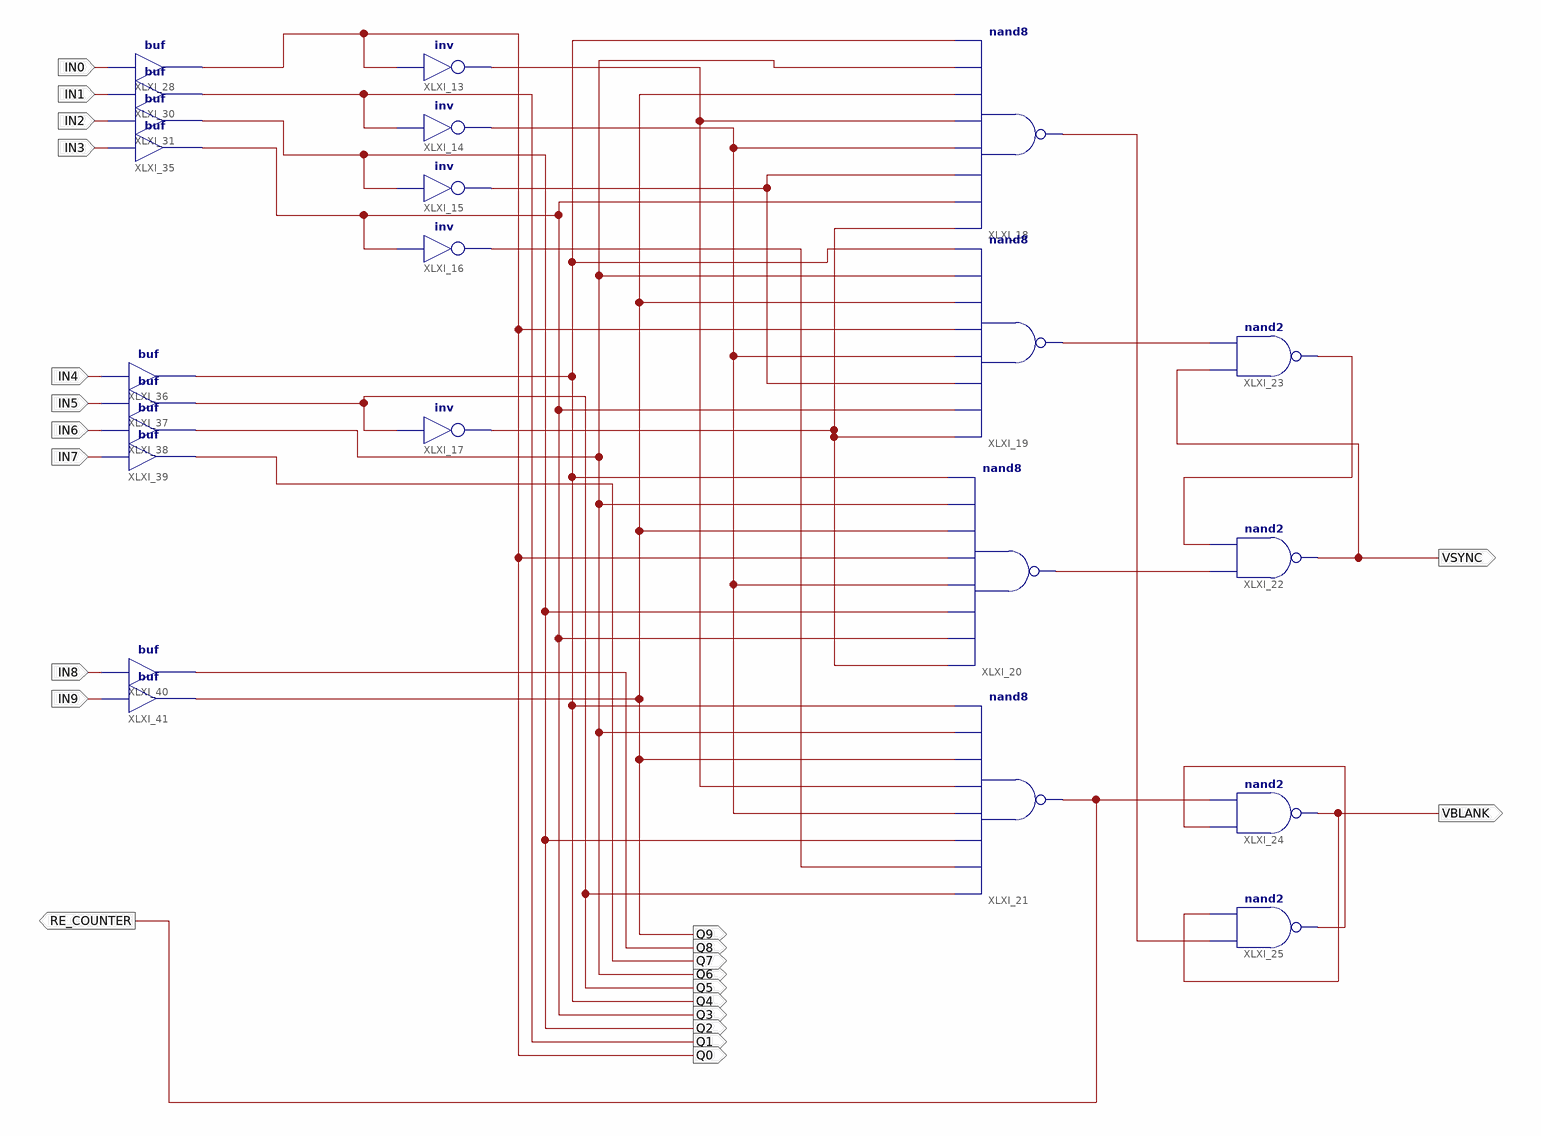
[diagram p0: schematic sheet 1]
// Xilinx ISE schematic vsync.sch (spartan6) as structural Verilog: 23 symbols, 23 ports
module vsync (
  input  IN0,
  input  IN1,
  input  IN2,
  input  IN3,
  input  IN4,
  input  IN5,
  input  IN6,
  input  IN7,
  input  IN8,
  input  IN9,
  output Q0,
  output Q1,
  output Q2,
  output Q3,
  output Q4,
  output Q5,
  output Q6,
  output Q7,
  output Q8,
  output Q9,
  output VSYNC,
  output VBLANK,
  output RE_COUNTER
);

  wire XLXN_35, XLXN_38, XLXN_40, XLXN_42, XLXN_44, XLXN_84, XLXN_89, XLXN_90, XLXN_91, XLXN_93;

  not XLXI_13 (XLXN_35, Q0);
  not XLXI_14 (XLXN_38, Q1);
  not XLXI_15 (XLXN_40, Q2);
  not XLXI_16 (XLXN_42, Q3);
  not XLXI_17 (XLXN_44, Q5);
  nand XLXI_18 (XLXN_89, XLXN_44, Q3, XLXN_40, XLXN_38, XLXN_35, Q9, Q6, Q4);
  nand XLXI_19 (XLXN_84, XLXN_44, Q3, XLXN_40, XLXN_38, Q0, Q9, Q6, Q4);
  nand XLXI_20 (XLXN_90, XLXN_44, Q3, Q2, XLXN_38, Q0, Q9, Q6, Q4);
  nand XLXI_21 (RE_COUNTER, Q5, XLXN_42, Q2, XLXN_38, XLXN_35, Q9, Q6, Q4);
  nand XLXI_22 (VSYNC, XLXN_90, XLXN_91);
  nand XLXI_23 (XLXN_91, VSYNC, XLXN_84);
  nand XLXI_24 (VBLANK, XLXN_93, RE_COUNTER);
  nand XLXI_25 (XLXN_93, XLXN_89, VBLANK);
  buf XLXI_28 (Q0, IN0);
  buf XLXI_30 (Q1, IN1);
  buf XLXI_31 (Q2, IN2);
  buf XLXI_35 (Q3, IN3);
  buf XLXI_36 (Q4, IN4);
  buf XLXI_37 (Q5, IN5);
  buf XLXI_38 (Q6, IN6);
  buf XLXI_39 (Q7, IN7);
  buf XLXI_40 (Q8, IN8);
  buf XLXI_41 (Q9, IN9);
endmodule
